# Altium schematic sheet 可控硅MOSFET.SchDoc
size A3
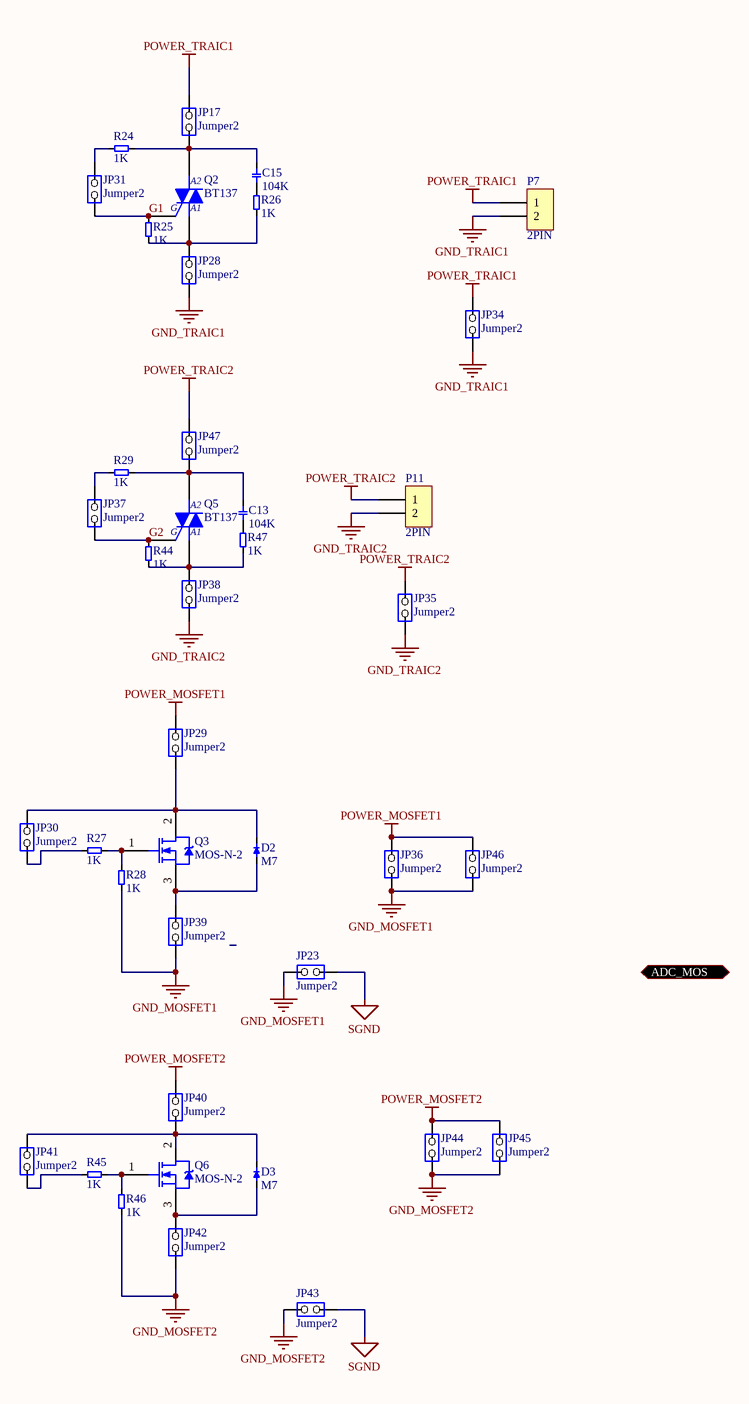
[diagram p0: 可控硅MOSFET.SchDoc]

## Parts
C13  104K  [方形P15T6L18H12]
C15  104K  [方形P15T6L18H12]
D2  M7  [SMA]
D3  M7  [SMA]
JP17  Jumper2  [CON2-P2.54]
JP23  Jumper2  [CON2-P2.54]
JP28  Jumper2  [CON2-P2.54]
JP29  Jumper2  [CON2-P2.54]
JP30  Jumper2  [CON2-P2.54]
JP31  Jumper2  [CON2-P2.54]
JP34  Jumper2  [CON2-P2.54]
JP35  Jumper2  [CON2-P2.54]
JP36  Jumper2  [CON2-P2.54]
JP37  Jumper2  [CON2-P2.54]
JP38  Jumper2  [CON2-P2.54]
JP39  Jumper2  [CON2-P2.54]
JP40  Jumper2  [CON2-P2.54]
JP41  Jumper2  [CON2-P2.54]
JP42  Jumper2  [CON2-P2.54]
JP43  Jumper2  [CON2-P2.54]
JP44  Jumper2  [CON2-P2.54]
JP45  Jumper2  [CON2-P2.54]
JP46  Jumper2  [CON2-P2.54]
JP47  Jumper2  [CON2-P2.54]
P7  2PIN  [CON2-P3.96(VH)]
P11  2PIN  [CON2-P3.96(VH)]
Q2  BT137  [TO-252-2L]
Q3  MOS-N-2  [TO-252-2L]
Q5  BT137  [TO-252-2L]
Q6  MOS-N-2  [TO-252-2L]
R24  1K  [1206]
R25  1K  [1206]
R26  1K  [1206]
R27  1K  [1206]
R28  1K  [1206]
R29  1K  [1206]
R44  1K  [1206]
R45  1K  [1206]
R46  1K  [1206]
R47  1K  [1206]

## Ports
ADC_MOS

## Nets
GND_MOSFET1: JP23.2(NO) JP36.1(COMMON) JP39.1(COMMON) JP46.1(COMMON) R28.2
GND_MOSFET2: JP42.1(COMMON) JP43.2(NO) JP44.1(COMMON) JP45.1(COMMON) R46.2
GND_TRAIC1: JP28.1(COMMON) JP34.1(COMMON) P7.2
GND_TRAIC2: JP35.1(COMMON) JP38.1(COMMON) P11.2
POWER_MOSFET1: JP29.2(NO) JP36.2(NO) JP46.2(NO)
POWER_MOSFET2: JP40.2(NO) JP44.2(NO) JP45.2(NO)
POWER_TRAIC1: JP17.2(NO) JP34.2(NO) P7.1
POWER_TRAIC2: JP35.2(NO) JP47.2(NO) P11.1
SGND: JP23.1(COMMON) JP43.1(COMMON)
G1: JP31.1(COMMON) Q2.3(G) R25.2
G2: JP37.1(COMMON) Q5.3(G) R44.2
NetC13_1: C13.1 R47.2
NetC13_2: C13.2 JP47.1(COMMON) Q5.2(A2) R29.2
NetC15_1: C15.1 R26.2
NetC15_2: C15.2 JP17.1(COMMON) Q2.2(A2) R24.2
NetD2_1: D2.1 JP29.1(COMMON) JP30.2(NO) Q3.2(D)
NetD2_2: D2.2 JP39.2(NO) Q3.3(S)
NetD3_1: D3.1 JP40.1(COMMON) JP41.2(NO) Q6.2(D)
NetD3_2: D3.2 JP42.2(NO) Q6.3(S)
NetJP28_2: JP28.2(NO) Q2.1(A1) R25.1 R26.1
NetJP30_1: JP30.1(COMMON) R27.2
NetJP31_2: JP31.2(NO) R24.1
NetJP37_2: JP37.2(NO) R29.1
NetJP38_2: JP38.2(NO) Q5.1(A1) R44.1 R47.1
NetJP41_1: JP41.1(COMMON) R45.2
NetQ3_1: Q3.1(G) R27.1 R28.1
NetQ6_1: Q6.1(G) R45.1 R46.1

## Library data of the parts
C13 C15 = Cap: 电容; Specifications: 16V,±10%; Published: 8-Jun-2000; LatestRevisionDate: 17-Jul-2002; LatestRevisionNote: Re-released for DXP Platform.; PackageReference: RAD-0.3; Publisher: Altium Limited; Value: 104K
D2 D3 = Diode: 二极管; Published: 8-Jun-2000; LatestRevisionDate: 17-Jul-2002; LatestRevisionNote: Re-released for DXP Platform.; PackageVersion: Sep-1996; PackageReference: SMC; Publisher: Altium Limited; Code_JEDEC: DO-214-AB; value: M7
P7 P11 = Header 2: 连接器; specification: pitch3.96mm VH; LatestRevisionDate: 17-Jul-2002; LatestRevisionNote: Re-released for DXP Platform.; Publisher: Altium Limited; Value: 2PIN
Q2 Q5 = Triac: 可控硅; Note: Pin 2 is electrically connected to Pin 4 (TAB); Published: 29-Sep-2000; LatestRevisionDate: 17-Jul-2002; LatestRevisionNote: Re-released for DXP Platform.; DatasheetVersion: 1999; PackageReference: 369-03; Publisher: Altium Limited; Code_JEDEC: TO-251-AA; ComponentLink1Description: Manufacturer Link; ComponentLink1URL: http://www.motorola.com/; value: BT137
Q3 Q6 = MOS-N-2: N-Channel Power MOSFET; Note: Pin 2 is electrically connected to pin 4.; Published: 8-Jun-2000; LatestRevisionDate: 17-Jul-2002; LatestRevisionNote: Re-released for DXP Platform.; DatasheetVersion: PD-9.814; PackageReference: TO-220AB; Publisher: Altium Limited; Code_JEDEC: TO-220-AB; ComponentLink1Description: Manufacturer Link; ComponentLink1URL: http://www.irf.com/
R24-R29 R44-R47 = Res1: 电阻; Specifications: ±1%; Published: 8-Jun-2000; LatestRevisionDate: 17-Jul-2002; LatestRevisionNote: Re-released for DXP Platform.; PackageReference: AXIAL-0.3; Publisher: Altium Limited; Value: 1K